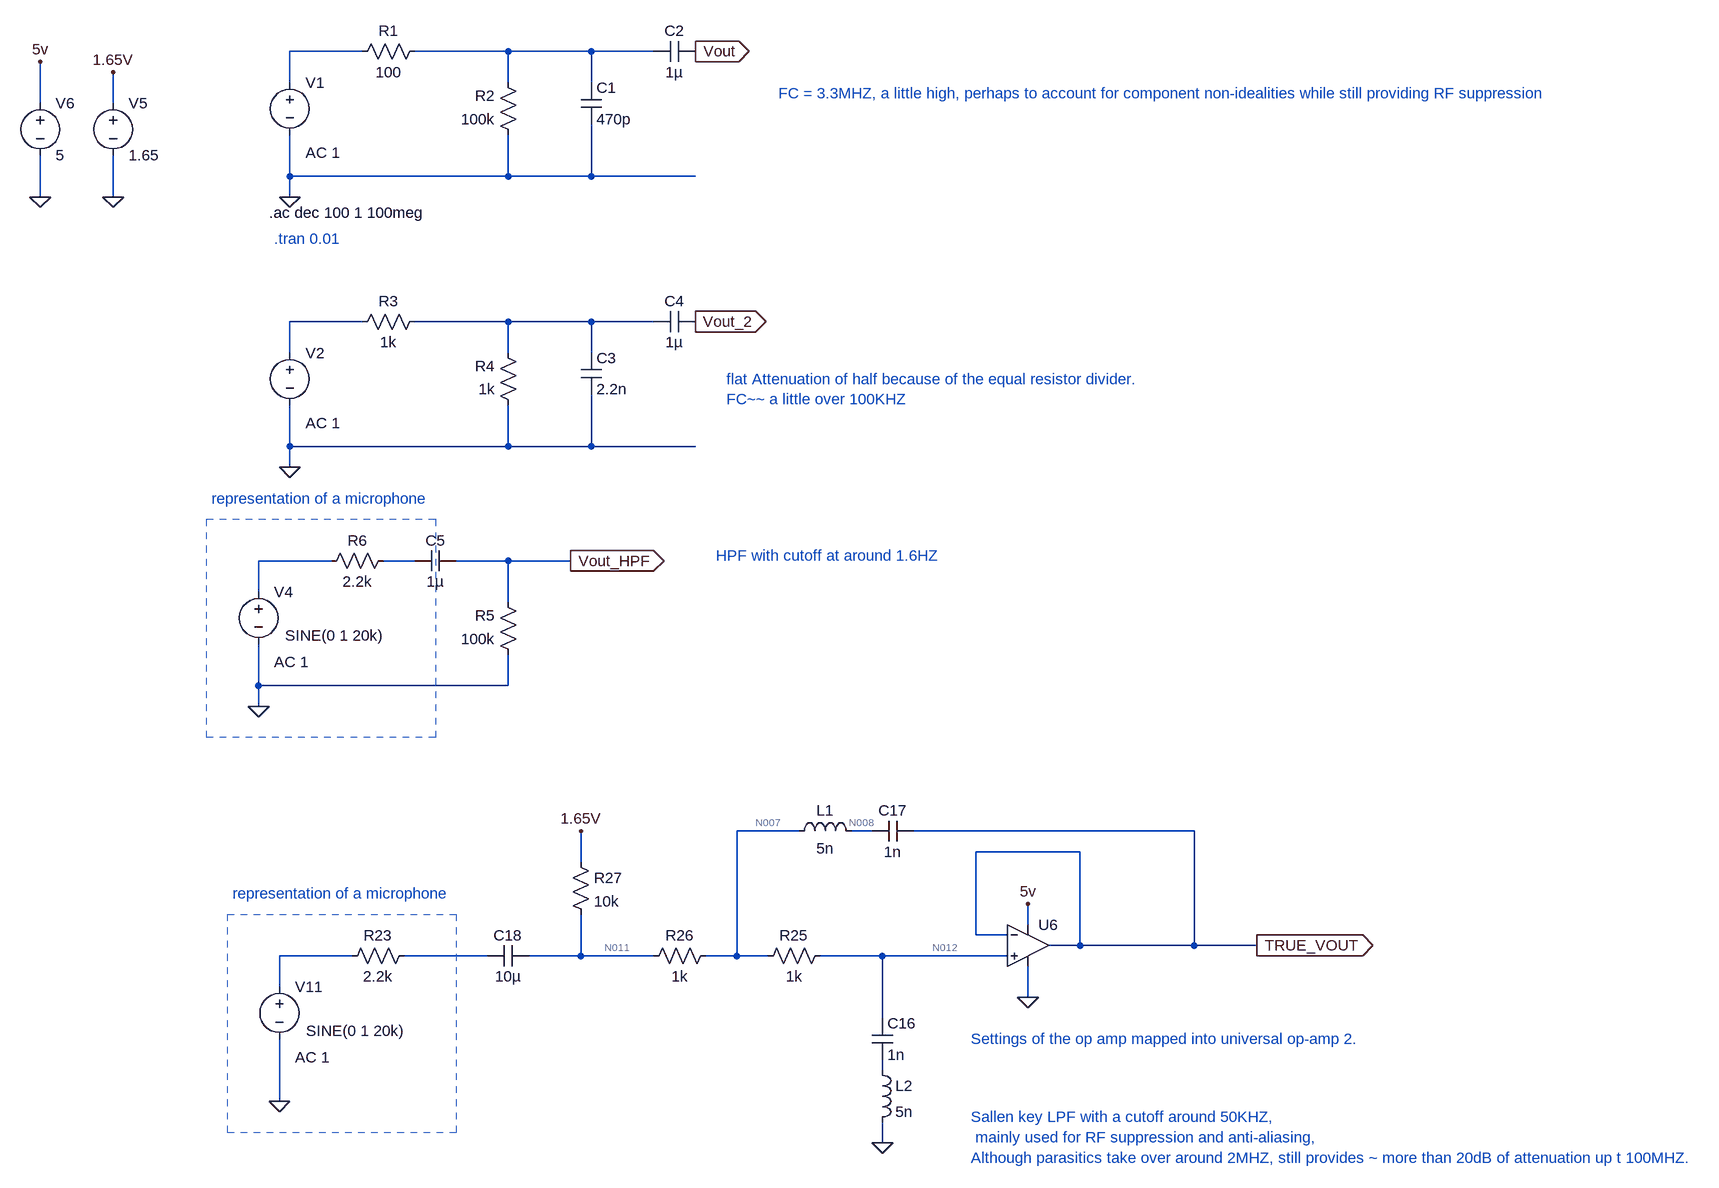
[diagram p0: schematic analogue_front_end_filters.asc]
analogue_front_end_filters.asc, the LTspice schematic file:
Version 4.1
SHEET 1 3328 4676
WIRE 80 112 -32 112
WIRE 304 112 160 112
WIRE 432 112 304 112
WIRE 528 112 432 112
WIRE -32 160 -32 112
WIRE 304 160 304 112
WIRE 432 160 432 112
WIRE -416 192 -416 128
WIRE -304 192 -304 144
WIRE -32 304 -32 240
WIRE 304 304 304 240
WIRE 304 304 -32 304
WIRE 432 304 432 224
WIRE 432 304 304 304
WIRE 592 304 432 304
WIRE -416 336 -416 272
WIRE -304 336 -304 272
WIRE -32 336 -32 304
WIRE 80 528 -32 528
WIRE 304 528 160 528
WIRE 432 528 304 528
WIRE 528 528 432 528
WIRE -32 576 -32 528
WIRE 304 576 304 528
WIRE 432 576 432 528
WIRE -32 720 -32 656
WIRE 304 720 304 656
WIRE 304 720 -32 720
WIRE 432 720 432 640
WIRE 432 720 304 720
WIRE 592 720 432 720
WIRE -32 752 -32 720
WIRE 32 896 -80 896
WIRE 160 896 112 896
WIRE 304 896 224 896
WIRE 400 896 304 896
WIRE -80 944 -80 896
WIRE 304 960 304 896
WIRE -80 1088 -80 1024
WIRE 304 1088 304 1040
WIRE 304 1088 -80 1088
WIRE -80 1120 -80 1088
WIRE 752 1312 656 1312
WIRE 864 1312 832 1312
WIRE 1360 1312 928 1312
WIRE 1184 1344 1024 1344
WIRE 416 1360 416 1312
WIRE 1104 1456 1104 1424
WIRE 1024 1472 1024 1344
WIRE 1072 1472 1024 1472
WIRE 1184 1488 1184 1344
WIRE 1184 1488 1136 1488
WIRE 1360 1488 1360 1312
WIRE 1360 1488 1184 1488
WIRE 1456 1488 1360 1488
WIRE 64 1504 -48 1504
WIRE 272 1504 144 1504
WIRE 416 1504 416 1440
WIRE 416 1504 336 1504
WIRE 528 1504 416 1504
WIRE 656 1504 656 1312
WIRE 656 1504 608 1504
WIRE 704 1504 656 1504
WIRE 880 1504 784 1504
WIRE 1072 1504 880 1504
WIRE -48 1552 -48 1504
WIRE 1104 1568 1104 1520
WIRE 880 1600 880 1504
WIRE 880 1680 880 1664
WIRE -48 1728 -48 1632
WIRE 880 1792 880 1760
FLAG -32 336 0
FLAG 592 112 Vout
IOPIN 592 112 Out
FLAG -32 752 0
FLAG 592 528 Vout_2
IOPIN 592 528 Out
FLAG 400 896 Vout_HPF
IOPIN 400 896 Out
FLAG -304 336 0
FLAG -304 144 1.65V
FLAG -416 336 0
FLAG -416 128 5v
FLAG -48 1728 0
FLAG 880 1792 0
FLAG 1456 1488 TRUE_VOUT
IOPIN 1456 1488 Out
FLAG 1104 1424 5v
FLAG 416 1312 1.65V
FLAG 1104 1568 0
FLAG -80 1120 0
SYMBOL res 176 96 R90
WINDOW 0 0 56 VBottom 2
WINDOW 3 32 56 VTop 2
SYMATTR InstName R1
SYMATTR Value 100
SYMBOL res 320 256 R180
WINDOW 0 36 76 Left 2
WINDOW 3 36 40 Left 2
SYMATTR InstName R2
SYMATTR Value 100k
SYMBOL cap 416 160 R0
SYMATTR InstName C1
SYMATTR Value 470p
SYMBOL voltage -32 144 R0
WINDOW 123 24 124 Left 2
WINDOW 39 0 0 Left 0
SYMATTR Value2 AC 1
SYMATTR InstName V1
SYMATTR Value ""
SYMBOL cap 592 96 R90
WINDOW 0 0 32 VBottom 2
WINDOW 3 32 32 VTop 2
SYMATTR InstName C2
SYMATTR Value 1µ
SYMBOL res 176 512 R90
WINDOW 0 0 56 VBottom 2
WINDOW 3 32 56 VTop 2
SYMATTR InstName R3
SYMATTR Value 1k
SYMBOL res 320 672 R180
WINDOW 0 36 76 Left 2
WINDOW 3 36 40 Left 2
SYMATTR InstName R4
SYMATTR Value 1k
SYMBOL cap 416 576 R0
SYMATTR InstName C3
SYMATTR Value 2.2n
SYMBOL voltage -32 560 R0
WINDOW 123 24 124 Left 2
WINDOW 39 0 0 Left 0
SYMATTR Value2 AC 1
SYMATTR InstName V2
SYMATTR Value ""
SYMBOL cap 592 512 R90
WINDOW 0 0 32 VBottom 2
WINDOW 3 32 32 VTop 2
SYMATTR InstName C4
SYMATTR Value 1µ
SYMBOL cap 224 880 R90
WINDOW 0 0 32 VBottom 2
WINDOW 3 32 32 VTop 2
SYMATTR InstName C5
SYMATTR Value 1µ
SYMBOL res 320 1056 R180
WINDOW 0 36 76 Left 2
WINDOW 3 36 40 Left 2
SYMATTR InstName R5
SYMATTR Value 100k
SYMBOL voltage -304 176 R0
WINDOW 123 0 0 Left 0
WINDOW 39 0 0 Left 0
SYMATTR InstName V5
SYMATTR Value 1.65
SYMBOL voltage -416 176 R0
WINDOW 123 0 0 Left 0
WINDOW 39 0 0 Left 0
SYMATTR InstName V6
SYMATTR Value 5
SYMBOL res 160 1488 R90
WINDOW 0 0 56 VBottom 2
WINDOW 3 32 56 VTop 2
SYMATTR InstName R23
SYMATTR Value 2.2k
SYMBOL voltage -48 1536 R0
WINDOW 123 24 124 Left 2
WINDOW 39 0 0 Left 0
WINDOW 3 41 83 Left 2
SYMATTR Value2 AC 1
SYMATTR Value SINE(0 1 20k)
SYMATTR InstName V11
SYMBOL res 800 1488 R90
WINDOW 0 0 56 VBottom 2
WINDOW 3 32 56 VTop 2
SYMATTR InstName R25
SYMATTR Value 1k
SYMBOL cap 864 1600 R0
SYMATTR InstName C16
SYMATTR Value 1n
SYMBOL res 624 1488 R90
WINDOW 0 0 56 VBottom 2
WINDOW 3 32 56 VTop 2
SYMATTR InstName R26
SYMATTR Value 1k
SYMBOL cap 928 1296 R90
WINDOW 0 0 32 VBottom 2
WINDOW 3 32 32 VTop 2
SYMATTR InstName C17
SYMATTR Value 1n
SYMBOL OpAmps\\UniversalOpAmp2 1104 1488 R0
SYMATTR InstName U6
SYMATTR Value2 Avol=1Meg GBW=16meg Slew=9meg
SYMATTR SpiceLine Ilimit=40m Rail=1 Vos=0
SYMBOL cap 336 1488 R90
WINDOW 0 0 32 VBottom 2
WINDOW 3 32 32 VTop 2
SYMATTR InstName C18
SYMATTR Value 10µ
SYMBOL res 400 1344 R0
SYMATTR InstName R27
SYMATTR Value 10k
SYMBOL ind 736 1328 R270
WINDOW 0 32 56 VTop 2
WINDOW 3 5 56 VBottom 2
SYMATTR InstName L1
SYMATTR Value 5n
SYMBOL ind 864 1664 R0
SYMATTR InstName L2
SYMATTR Value 5n
SYMBOL res 128 880 R90
WINDOW 0 0 56 VBottom 2
WINDOW 3 32 56 VTop 2
SYMATTR InstName R6
SYMATTR Value 2.2k
SYMBOL voltage -80 928 R0
WINDOW 123 24 124 Left 2
WINDOW 39 0 0 Left 0
WINDOW 3 41 83 Left 2
SYMATTR Value2 AC 1
SYMATTR Value SINE(0 1 20k)
SYMATTR InstName V4
TEXT -64 360 Left 2 !.ac dec 100 1 100meg
TEXT 720 176 Left 2 ;FC = 3.3MHZ, a little high, perhaps to account for component non-idealities while still providing RF suppression
TEXT 640 616 Left 2 ;flat Attenuation of half because of the equal resistor divider.\nFC~~ a little over 100KHZ
TEXT -56 400 Left 2 ;.tran 0.01
TEXT 624 888 Left 2 ;HPF with cutoff at around 1.6HZ
TEXT -120 1408 Left 2 ;representation of a microphone
TEXT 1016 1632 Left 2 ;Settings of the op amp mapped into universal op-amp 2.
TEXT -152 800 Left 2 ;representation of a microphone
TEXT 1016 1752 Left 2 ;Sallen key LPF with a cutoff around 50KHZ,\n mainly used for RF suppression and anti-aliasing, \nAlthough parasitics take over around 2MHZ, still provides ~ more than 20dB of attenuation up t 100MHZ.
RECTANGLE Normal 224 1776 -128 1440 2
RECTANGLE Normal 192 1168 -160 832 2

The netlist it stands for:
* analogue_front_end_filters.asc
R1 N002 N001 100
R2 0 N002 100k
C1 N002 0 470p
V1 N001 0 AC 1
C2 Vout N002 1µ
R3 N004 N003 1k
R4 0 N004 1k
C3 N004 0 2.2n
V2 N003 0 AC 1
C4 Vout_2 N004 1µ
C5 Vout_HPF N006 1µ
R5 0 Vout_HPF 100k
V5 1.65V 0 1.65
V6 5v 0 5
R23 N010 N009 2.2k
V11 N009 0 SINE(0 1 20k) AC 1
R25 N012 N007 1k
C16 N012 N013 1n
R26 N007 N011 1k
C17 TRUE_VOUT N008 1n
X§U6 N012 TRUE_VOUT 5v 0 TRUE_VOUT level2 Avol=1Meg GBW=16meg Slew=9meg Ilimit=40m Rail=1 Vos=0 En=0 Enk=0 In=0 Ink=0 Rin=500Meg  ; pins In+ In- V+ V- OUT
C18 N011 N010 10µ
R27 1.65V N011 10k
L1 N007 N008 5n
L2 N013 0 5n
R6 N006 N005 2.2k
V4 N005 0 SINE(0 1 20k) AC 1
.ac dec 100 1 100meg
* FC = 3.3MHZ, a little high, perhaps to account for component non-idealities while still providing RF suppression
* flat Attenuation of half because of the equal resistor divider.
* FC~~ a little over 100KHZ
* .tran 0.01
* HPF with cutoff at around 1.6HZ
* representation of a microphone
* Settings of the op amp mapped into universal op-amp 2.
* representation of a microphone
* Sallen key LPF with a cutoff around 50KHZ,
*  mainly used for RF suppression and anti-aliasing,
* Although parasitics take over around 2MHZ, still provides ~ more than 20dB of attenuation up t 100MHZ.
.lib UniversalOpAmp2.lib
.backanno
.end

* Results of the author's LTspice run, read from the files saved beside the schematic
* Operating Point, zero values left out:
*   V(5v) = 5 V
*   V(n012) = 1.65 V
*   V(n008) = 1.65 V
*   V(1.65v) = 1.65 V
*   V(n007) = 1.65 V
*   V(n011) = 1.65 V
*   V(true_vout) = 1.65 V
*   I(V5) = 1.7 nA
*   I(R26) = 1.7 nA
*   I(R27) = -1.7 nA
*   I(V6) = -117.5 µA
*   I(R25) = 1.7 nA
*   Ix(u6:1) = -1.7 nA
*   Ix(u6:2) = -1.7 nA
*   Ix(u6:3) = 117.5 µA
*   Ix(u6:4) = -117.5 µA
*   Ix(u6:5) = 1.7 nA
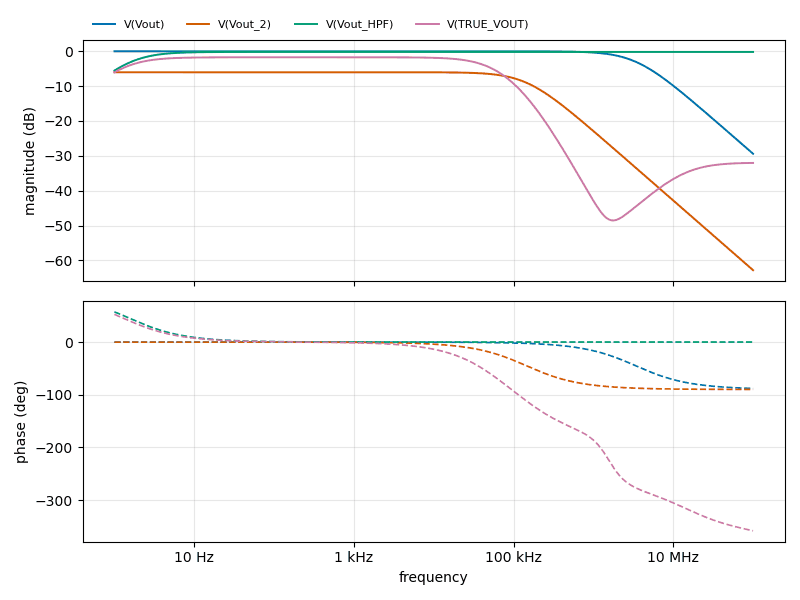
[diagram p1: AC Analysis of analogue_front_end_filters.asc, plotted from the saved traces]
* AC Analysis, 1 run:
*   V(Vout): -0.01 dB at 1 Hz, -29.41 dB at 100 MHz, peak -0.01 dB at 1 Hz, 3 dB below the peak at 3.39 MHz
*   V(Vout_2): -6.02 dB at 1 Hz, -62.81 dB at 100 MHz, peak -6.02 dB at 1 Hz, 3 dB below the peak at 144.7 kHz
*   V(Vout_HPF): -5.54 dB at 1 Hz, -0.19 dB at 100 MHz, peak -0.19 dB at 81.28 MHz, 3 dB below the peak at 1.557 Hz
*   V(TRUE_VOUT): -6.04 dB at 1 Hz, -32.04 dB at 100 MHz, peak -1.73 dB at 263 Hz, 3 dB below the peak at 1.305 Hz and 51.28 kHz